# EAGLE design Module-PCB (EAGLE 9.0.1)
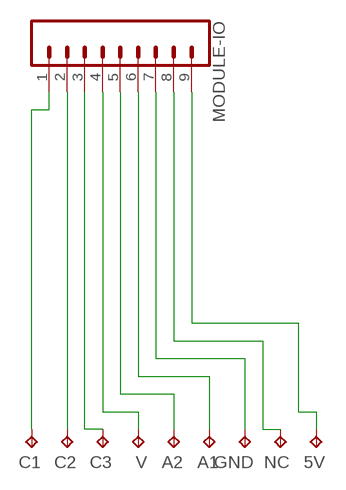
[diagram p0: schematic, sheet 1]

## Parts
5V  TPTP20SQ  [TP20SQ]
A1  TPTP20SQ  [TP20SQ]
A2  TPTP20SQ  [TP20SQ]
C1  TPTP20SQ  [TP20SQ]
C2  TPTP20SQ  [TP20SQ]
C3  TPTP20SQ  [TP20SQ]
GND  TPTP20SQ  [TP20SQ]
MODULE-IO  CONN_09  [1X09]
NC  TPTP20SQ  [TP20SQ]
V  TPTP20SQ  [TP20SQ]

## Nets
3: C3.TP MODULE-IO.3
GND: GND.TP MODULE-IO.7
N$1: C1.TP MODULE-IO.1
N$2: C2.TP MODULE-IO.2
N$4: MODULE-IO.4 V.TP
N$5: A2.TP MODULE-IO.5
N$6: A1.TP MODULE-IO.6
N$8: MODULE-IO.8 NC.TP
N$9: 5V.TP MODULE-IO.9

## Library data of the parts
5V A1 A2 C1-C3 GND NC V = testpad:TP: Test pad
MODULE-IO = SparkFun-Connectors:CONN_09: Multi connection point. Often used as Generic Header-pin footprint for 0.1 inch spaced/style header connections On any of the 0.1 inch spaced packages, you can populate with these: Break Away Headers - Straight <https://www.sparkfun.com/products/116> (PRT-00116) Break Away Male Headers - Right Angle <https://www.sparkfun.com/products/553> (PRT-00553) Female Headers <https://www.sparkfun.com/products/115> (PRT-00115) Break Away Headers - Machine Pin <https://www.sparkfun.com/products/117> (PRT-00117) Break Away Female Headers - Swiss Machine Pin <https://www.sparkfun.com/products/743> (PRT-00743) For SCREWTERMINALS and SPRING TERMINALS visit here: Screw Terimnals on SparkFun.com <https://www.sparkfun.com/search/results?term=Screw+Terminals> (5mm/3.5mm/2.54mm spacing) This device is also useful as a general connection point to wire up your design to another part of your project. Our various solder wires solder well into these plated through hole pads. Hook-Up Wire - Assortment (Stranded, 22 AWG) <https://www.sparkfun.com/products/11375> (PRT-11375) Hook-Up Wire - Assortment (Solid Core, 22 AWG) <https://www.sparkfun.com/products/11367> (PRT-11367) View the entire wire category on our website here <https://www.sparkfun.com/categories/141> Special notes: Molex polarized connector foot print use with SKU : PRT-08231 with associated crimp pins and housings. 1MM SMD Version SKU: PRT-10208 NOTES ON THE VARIANTS LOCK and LOCK_LONGPADS... This footprint was designed to help hold the alignment of a through-hole component (i.e. 6-pin header) while soldering it into place. You may notice that each hole has been shifted either up or down by 0.005 of an inch from it's more standard position (which is a perfectly straight line). This slight alteration caused the pins (the squares in the middle) to touch the edges of the holes. Because they are alternating, it causes a "brace" to hold the component in place. 0.005 has proven to be the perfect amount of "off-center" position when using our standard breakaway headers. Although looks a little odd when you look at the bare footprint, once you have a header in there, the alteration is very hard to notice. Also,if you push a header all the way into place, it is covered up entirely on the bottom side.

## Net classes
0 default: width 0.5 mm, drill 0.5 mm, clearance 0.5 mm

## Board
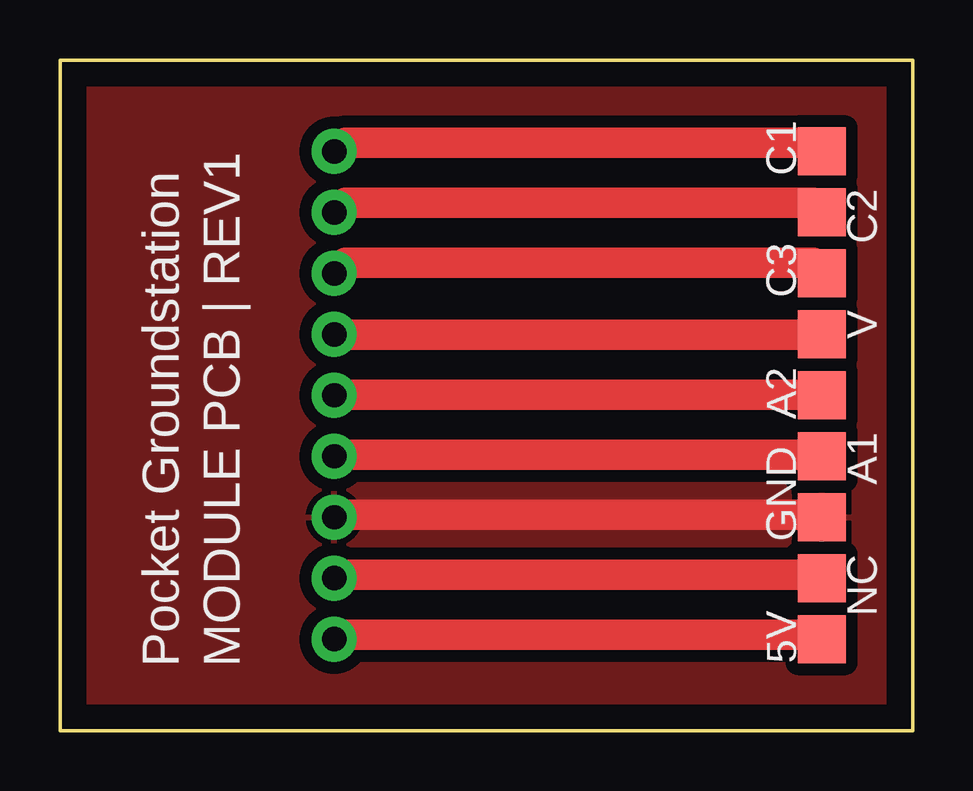
[diagram p1: board, top side]
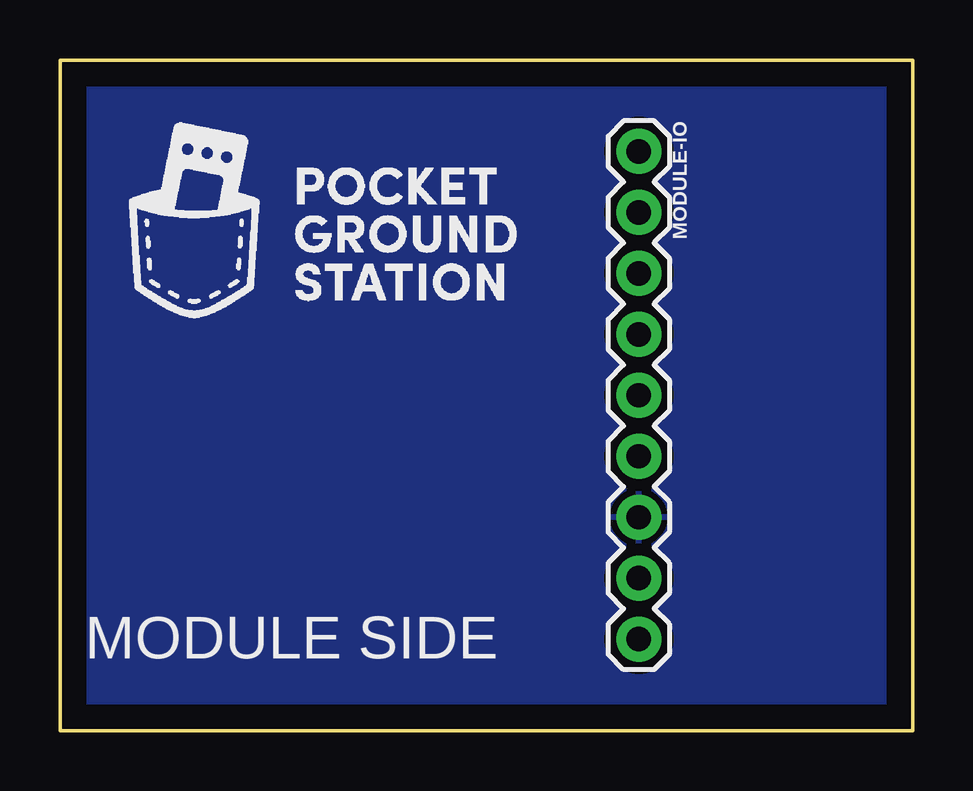
[diagram p2: board, bottom side, seen from below]

Size 35.56 x 27.94 mm. Coordinates in mm from the lower left corner, seen from the top.
Outline: 0,27.94 35.56,27.94 35.56,0 0,0 0,27.94
Copper layers (1*16): Top 0.035mm / dielectric 1.5mm / Bottom 0.035mm
Design rules "default": minimum track width 6mil, minimum drill 0.35mm, track to track 6mil, track to pad 6mil, pad to pad 6mil, via to via 6mil, smd to smd 6mil, copper to edge 40mil, drill to drill 6mil, minimum pad ring 10mil, minimum via ring 8mil, stop-mask expansion 4mil, vias tented up to drill 0mil, thermal gap 10mil

### Footprints (pad centres in the part's own frame; a part is rotated, then mirrored left to right if it is on the bottom)
TP20SQ = smd 2 x 2: TP 0,0
1X09 = drill 1.016 pad 1.88: 1 0,0; 2 2.54,0; 3 5.08,0; 4 7.62,0; 5 10.16,0; 6 12.7,0; 7 15.24,0; 8 17.78,0; 9 20.32,0

### Placement (x,y rotation side)
5V  31.75,3.81 90 top
A1  31.75,11.43 270 top
A2  31.75,13.97 90 top
C1  31.75,24.13 90 top
C2  31.75,21.59 270 top
C3  31.75,19.05 90 top
GND  31.75,8.89 90 top
MODULE-IO  11.43,24.13 270 bottom
NC  31.75,6.35 270 top
V  31.75,16.51 270 top

### Tracks (layer width: path | path; a pad name or v marks a point on that pad's centre or on a via)
3
  Top 0.5: 31.41,19.5 C3.TP | 11.91,19.5 MODULE-IO.3
  Top 1.27: 11.91,19.5 31.41,19.5
GND
  Top 0.5: 31.41,9 GND.TP | 11.91,9 MODULE-IO.7
  Top 1.27: 11.91,9 31.41,9
  pour Top: 0,29.21 35.56,29.21 35.56,0 0,0
  pour Bottom: -1.27,29.21 -1.27,-1.27 36.83,-1.27 36.83,29.21
N$1
  Top 0.5: 31.41,24.5 C1.TP | 11.91,24.5 MODULE-IO.1
  Top 1.27: 11.91,24.5 31.41,24.5
N$2
  Top 0.5: 31.41,22 C2.TP | 11.91,22 MODULE-IO.2
  Top 1.27: 11.91,22 31.41,22
N$4
  Top 0.5: 31.41,16.5 V.TP | 11.91,16.5 MODULE-IO.4
  Top 1.27: 11.91,16.5 31.41,16.5
N$5
  Top 0.5: 31.41,14 A2.TP | 11.91,14 MODULE-IO.5
  Top 1.27: 11.91,14 31.41,14
N$6
  Top 0.5: 31.41,11.5 A1.TP | 11.91,11.5 MODULE-IO.6
  Top 1.27: 11.91,11.5 31.41,11.5
N$8
  Top 0.5: 31.41,6.5 NC.TP | 11.91,6.5 MODULE-IO.8
  Top 1.27: 11.91,6.5 31.41,6.5
N$9
  Top 0.5: 31.41,4 5V.TP | 11.91,4 MODULE-IO.9
  Top 1.27: 11.91,4 31.41,4

### Text on the board
tNames: Pocket Groundstation | MODULE PCB | REV1
bNames: MODULE SIDE